# Altium schematic sheet TIDA-00643_C2000.SchDoc
size 431 x 279 mm; Date: Not shown in title block; ApprovedBy: Not shown in title block; CheckedBy: Not shown in title block; Author: Not shown in title block; CompanyName: Not shown in title block; Engineer: Not shown in title block; Organization: Not shown in title block; Address1: Not shown in title block; Address2: Not shown in title block; Address3: Not shown in title block; Address4: Not shown in title block; DocumentNumber: 5; Revision: Use project parameter SCH_Rev; SheetNumber: 5; SheetTotal: 5; PageSetup: Record=PageOptions|CenterHorizontal=True|CenterVertical=True|PrintScale=1.00|XCorrection=1.00|YCorrection=1.00|PrintKind=0|BorderSize=5000000|LeftOffset=0|BottomOffset=0|Orientation=2|PaperLength=1000|PaperWidth=1000|Scale=100|PaperSource=15|PrintQuality=600|MediaType=1|DitherType=10|PaperKind=Letter|PrintScaleMode=1; CurrentTime: Not shown in title block; CurrentDate: Not shown in title block; Time: Not shown in title block; DocumentFullPathAndName: Not shown in title block; DocumentName: Not shown in title block; ModifiedDate: Not shown in title block; ImagePath: Not shown in title block
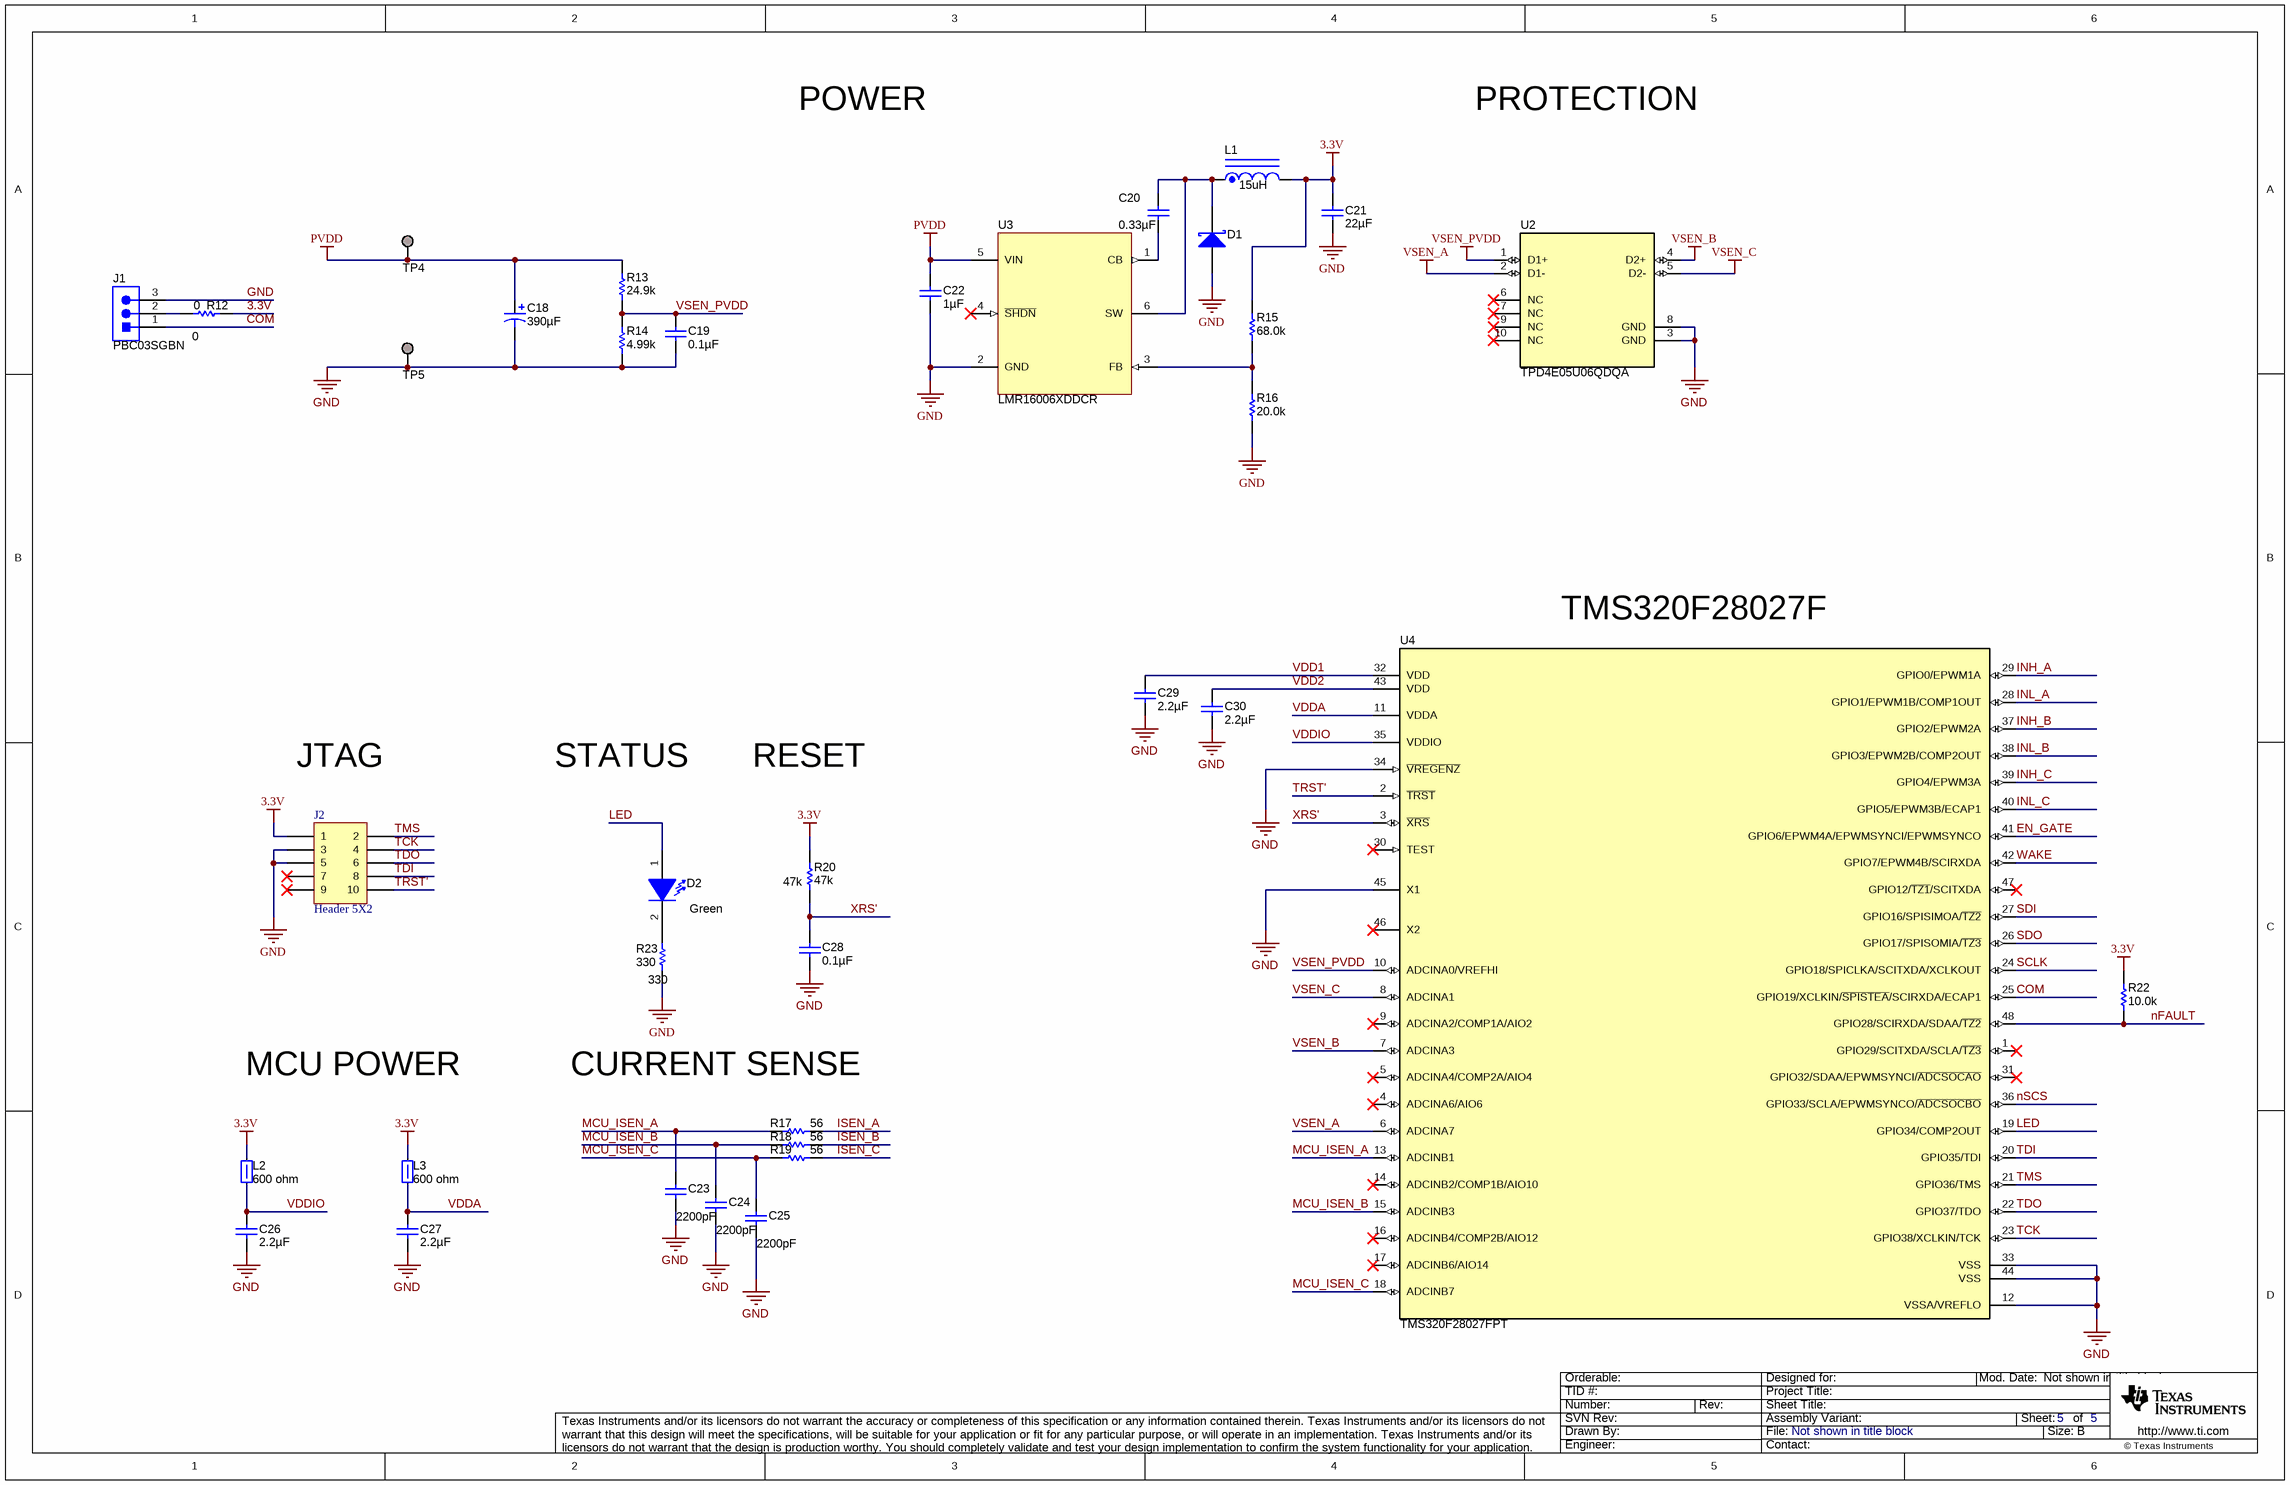
[diagram p0: TIDA-00643_C2000.SchDoc]

## Parts
C18  ValueDisplayed: 390µF  [CAPAE1030X1080]  (hidden comment: EEE-FPV391UAP)
C19  ValueDisplayed: 0.1µF  [0402L]  (hidden comment: 885012105016)
C20  ValueDisplayed: 0.33µF  [0603L]  (hidden comment: C0603C334Z3VACTU)
C21  ValueDisplayed: 22µF  [0805L]  (hidden comment: C2012X5R1C226K125AC)
C22  ValueDisplayed: 1µF  [0603L]  (hidden comment: GMK107BJ105KA-T)
C23  ValueDisplayed: 2200pF  [0402L]  (hidden comment: GRM155R71C222KA01D)
C24  ValueDisplayed: 2200pF  [0402L]  (hidden comment: GRM155R71C222KA01D)
C25  ValueDisplayed: 2200pF  [0402L]  (hidden comment: GRM155R71C222KA01D)
C26  ValueDisplayed: 2.2µF  [0603L]  (hidden comment: GRM188R61C225KE15D)
C27  ValueDisplayed: 2.2µF  [0603L]  (hidden comment: GRM188R61C225KE15D)
C28  ValueDisplayed: 0.1µF  [0402L]  (hidden comment: 885012105016)
C29  ValueDisplayed: 2.2µF  [0603L]  (hidden comment: GRM188R61C225KE15D)
C30  ValueDisplayed: 2.2µF  [0603L]  (hidden comment: GRM188R61C225KE15D)
D1  MBR1H100SFT3G  [SOD-123FL]  (value not drawn)
D2  value Green  [LED_LTST-C171]  (hidden comment: LTST-C171GKT)
J1  PBC03SGBN  [Sullins_xxC03SGBN]
J2  Header 5X2  [IDC DC3-10P 2X5P]
L1  value 15uH  [SD53]  (hidden comment: SD53-150-R)
L2  value 600 ohm  [0603L]  (hidden comment: BLM18KG601SN1D)
L3  value 600 ohm  [0603L]  (hidden comment: BLM18KG601SN1D)
R12  value 0  [0603L]  (hidden comment: CRCW06030000Z0EA)
R13  ValueDisplayed: 24.9k  [0603L]  (hidden comment: RC0603FR-0724K9L)
R14  ValueDisplayed: 4.99k  [0402L]  (hidden comment: CRCW04024K99FKED)
R15  ValueDisplayed: 68.0k  [0603L]  (hidden comment: RC0603FR-0768KL)
R16  ValueDisplayed: 20.0k  [0603L]  (hidden comment: CRCW060320K0FKEA)
R17  ValueDisplayed: 56  [0402L]  (hidden comment: CRCW040256R0JNED)
R18  ValueDisplayed: 56  [0402L]  (hidden comment: CRCW040256R0JNED)
R19  ValueDisplayed: 56  [0402L]  (hidden comment: CRCW040256R0JNED)
R20  value 47k  [0603L]  (hidden comment: CRCW060347K0JNEA)
R22  ValueDisplayed: 10.0k  [0603L]  (hidden comment: RC0603FR-0710KL)
R23  value 330  [0603L]  (hidden comment: CRCW0603330RJNEA)
TP4  TESTPOINT  [TESTPOINT]  (value not drawn)  (no BOM)
TP5  TESTPOINT  [TESTPOINT]  (value not drawn)  (no BOM)
U2  TPD4E05U06QDQA  [DQA0010A]
U3  LMR16006XDDCR  [DDC0006A_N]
U4  TMS320F28027FPT  [PT0048A_L]

## Nets
3.3V: C21.1 J2.1 L1.2 L2.2 L3.2 R12.2 R15.2 R20.2 R22.2
GND: C18.2(-) C19.2 C21.2 C22.2 C23.2 C24.2 C25.2 C26.2 C27.2 C28.2 C29.2 C30.2 D1.2(A) J1.3 J2.3 J2.5 R14.1 R16.1 R23.1 TP5.1 U2.3(GND) U2.8(GND) U3.2(GND) U4.12(VSSA/VREFLO) U4.33(VSS) U4.34(~{VREGENZ}) U4.44(VSS) U4.45(X1)
PVDD: C18.1(+) C22.1 R13.2 TP4.1 U3.5(VIN)
VSEN_A: U2.2(D1-) U4.6(ADCINA7)
VSEN_B: U2.4(D2+) U4.7(ADCINA3)
VSEN_C: U2.5(D2-) U4.8(ADCINA1)
VSEN_PVDD: C19.1 R13.1 R14.2 U2.1(D1+) U4.10(ADCINA0/VREFHI)
COM: J1.1 U4.25(GPIO19/XCLKIN/~{SPISTEA}/SCIRXDA/ECAP1)
EN_GATE: U4.41(GPIO6/EPWM4A/EPWMSYNCI/EPWMSYNCO)
INH_A: U4.29(GPIO0/EPWM1A)
INH_B: U4.37(GPIO2/EPWM2A)
INH_C: U4.39(GPIO4/EPWM3A)
INL_A: U4.28(GPIO1/EPWM1B/COMP1OUT)
INL_B: U4.38(GPIO3/EPWM2B/COMP2OUT)
INL_C: U4.40(GPIO5/EPWM3B/ECAP1)
ISEN_A: R17.2
ISEN_B: R18.2
ISEN_C: R19.2
LED: D2.1(A) U4.19(GPIO34/COMP2OUT)
MCU_ISEN_A: C23.1 R17.1 U4.13(ADCINB1)
MCU_ISEN_B: C24.1 R18.1 U4.15(ADCINB3)
MCU_ISEN_C: C25.1 R19.1 U4.18(ADCINB7)
nFAULT: R22.1 U4.48(GPIO28/SCIRXDA/SDAA/~{TZ2})
nSCS: U4.36(GPIO33/SCLA/EPWMSYNCO/~{ADCSOCBO})
SCLK: U4.24(GPIO18/SPICLKA/SCITXDA/XCLKOUT)
SDI: U4.27(GPIO16/SPISIMOA/~{TZ2})
SDO: U4.26(GPIO17/SPISOMIA/~{TZ3})
TCK: J2.4 U4.23(GPIO38/XCLKIN/TCK)
TDI: J2.8 U4.20(GPIO35/TDI)
TDO: J2.6 U4.22(GPIO37/TDO)
TMS: J2.2 U4.21(GPIO36/TMS)
TRST': J2.10 U4.2(~{TRST})
VDD1: C29.1 U4.32(VDD)
VDD2: C30.1 U4.43(VDD)
VDDA: C27.1 L3.1 U4.11(VDDA)
VDDIO: C26.1 L2.1 U4.35(VDDIO)
WAKE: U4.42(GPIO7/EPWM4B/SCIRXDA)
XRS': C28.1 R20.1 U4.3(~{XRS})
NetC20_1: C20.1 D1.1(K) L1.1 U3.6(SW)
NetC20_2: C20.2 U3.1(CB)
NetD2_2: D2.2(K) R23.2
NetJ1_2: J1.2 R12.1
NetR15_1: R15.1 R16.2 U3.3(FB)

Not connected (* = marked no-connect by the designer): J2 7* 9*; U2 6(NC)* 7(NC)* 9(NC)* 10(NC)*; U3 4(~{SHDN})*; U4 1(GPIO29/SCITXDA/SCLA/~{TZ3})* 4(ADCINA6/AIO6)* 5(ADCINA4/COMP2A/AIO4)* 9(ADCINA2/COMP1A/AIO2)* 14(ADCINB2/COMP1B/AIO10)* 16(ADCINB4/COMP2B/AIO12)* 17(ADCINB6/AIO14)* 30(TEST)* 31(GPIO32/SDAA/EPWMSYNCI/~{ADCSOCAO})* 46(X2)* 47(GPIO12/~{TZ1}/SCITXDA)*

## Notes on the sheet
- POWER
- PROTECTION
- (near U4) TMS320F28027F
- JTAG
- STATUS
- RESET
- MCU POWER
- CURRENT SENSE
- Drawn By:
- SVN Rev:
- Number:
- TID #:
- Orderable:
- Rev:
- Sheet Title:
- File:
- Project Title:
- Designed for:
- Assembly Variant:
- Mod. Date:
- Sheet:
- Size:
- of
- B
- http://www.ti.com
- Texas Instruments and/or its licensors do not warrant the accuracy or completeness of this specification or any information contained therein. Texas Instruments and/or its licensors do not warrant that this design will meet the specifications, will be suitable for your application or fit for any particular purpose, or will operate in an implementation. Texas Instruments and/or its licensors do not warrant that the design is production worthy. You should completely validate and test your design implementation to confirm the system functionality for your application.
- Engineer:
- Contact:
- © Texas Instruments

## Library data of the parts
C18 = EEE-FPV391UAP: CAP, AL, 390 µF, 35 V, +/- 20%, 0.08 ohm, SMD; Manufacturer: Panasonic; Polarized: Y; CompType: Capacitor; Value: 390uF; U/M: EA; Cap_F: 0.00039; Tolerance_%: 20; VDC_V: 35; Value2: 35V; ESR_ohm: 0.08; IRMS_A: 0.85; TaMin_C: -55; TaMax_C: 105; Cap_Case: 10x10.2mm; SymbolVersion: 2008-07-09; PartNumber: EEE-FPV391UAP; PackageReference: 10 x 10; RoHS: Y; Value1: 0.08 ohm; MountType: SMT; Technology: AL; Series: FP; Publisher: Texas Instruments; LatestRevisionDate: 2015-07-10; ComponentLink1Description: Datasheet link; ComponentLink1URL: http://industrial.panasonic.com/lecs/www-data/pdf/ABA0000/ABA0000CE114.pdf; Supplier 1: Digi-Key; Supplier Part Number 1: PCE4446CT-ND; Supplier 2: Mouser; Supplier Part Number 2: 667-EEE-FPV391UAP
C19 C28 = 885012105016: CAP, CERM, 0.1 µF, 16 V, +/- 20%, X5R, 0402; Manufacturer: Wurth Elektronik; Polarized: N; CompType: Capacitor; Value: 0.1uF; U/M: EA; Cap_F: 0.0000001; Tolerance_%: 20; Value1: Unknown; VDC_V: 16; Value2: 16V; TaMin_C: -55; TaMax_C: 85; Cap_Case: 0402; SymbolVersion: 2008-07-09; PartNumber: 885012105016; PackageReference: 0402; RoHS: Y; MountType: SMT; Technology: Ceramic; TempCo: X5R; Published: 2008-06-19; Publisher: Texas Instruments; LatestRevisionDate: 2015-07-15; ComponentLink1Description: Datasheet link; ComponentLink1URL: http://katalog.we-online.de/pbs/datasheet/885012105016.pdf; Supplier 1: Mouser; Supplier Part Number 1: 710-885012105016; Supplier 2: Newark; Supplier Part Number 2: 40Y4445
C20 = C0603C334Z3VACTU: CAP, CERM, 0.33 µF, 25 V, +80/-20%, Y5V, 0603; Manufacturer: Kemet; Polarized: N; CompType: Capacitor; Value: 0.33uF; U/M: EA; Cap_F: 0.00000033; Tolerance_%: 80; Value1: Unknown; VDC_V: 25; Value2: 25V; TaMin_C: -30; TaMax_C: 85; Cap_Case: 0603; SymbolVersion: 2008-07-09; PartNumber: C0603C334Z3VACTU; PackageReference: 0603; RoHS: Y; MountType: SMT; Technology: Ceramic; TempCo: Y5V; Published: 2008-06-19; Publisher: Texas Instruments; LatestRevisionDate: 2015-07-15; ComponentLink1Description: Datasheet link; ComponentLink1URL: http://www.kemet.com/kemet/web/homepage/kechome.nsf/vapubfiles/F3102_Y5V.pdf/$file/F3102_Y5V.pdf; Supplier 1: Digi-Key; Supplier Part Number 1: 399-1292-1-ND; Supplier 2: Mouser; Supplier Part Number 2: 80-C0603C334Z3V; Supplier 3: Farnell; Supplier Part Number 3: 1163537
C21 = C2012X5R1C226K125AC: CAP, CERM, 22 µF, 16 V, +/- 10%, X5R, 0805; Manufacturer: TDK; Polarized: N; CompType: Capacitor; Value: 22uF; U/M: EA; Cap_F: 0.000022; Tolerance_%: 10; Value1: Unknown; VDC_V: 16; Value2: 16V; TaMin_C: -55; TaMax_C: 85; Cap_Case: 0805; SymbolVersion: 2008-07-09; PartNumber: C2012X5R1C226K125AC; PackageReference: 0805; RoHS: Y; MountType: SMT; Technology: Ceramic; TempCo: X5R; Published: 2008-06-19; Publisher: Texas Instruments; LatestRevisionDate: 2015-07-15; ComponentLink1Description: Datasheet link; ComponentLink1URL: http://product.tdk.com/capacitor/mlcc/en/documents/C2012X5R1C226K125AC.pdf; Supplier 1: Digi-Key; Supplier Part Number 1: 445-6797-1-ND; Supplier 2: Mouser; Supplier Part Number 2: 810-C2012X5R1C226K; Supplier 3: Farnell; Supplier Part Number 3: 2346925
C22 = GMK107BJ105KA-T: CAP, CERM, 1 µF, 35 V, +/- 10%, X5R, 0603; Manufacturer: Taiyo Yuden; Polarized: N; CompType: Capacitor; Value: 1uF; U/M: EA; Cap_F: 0.000001; Tolerance_%: 10; Value1: Unknown; VDC_V: 35; Value2: 35V; TaMin_C: -55; TaMax_C: 85; Cap_Case: 0603; SymbolVersion: 2008-07-09; PartNumber: GMK107BJ105KA-T; PackageReference: 0603; RoHS: Y; MountType: SMT; Technology: Ceramic; TempCo: X5R; Published: 2008-06-19; Publisher: Texas Instruments; LatestRevisionDate: 2015-07-15; ComponentLink1Description: Datasheet link; ComponentLink1URL: http://www.yuden.co.jp/or/product/category/capacitor/GMK107BJ105KA-T.pdf; Supplier 1: Digi-Key; Supplier Part Number 1: 587-1437-1-ND; Supplier 2: Mouser; Supplier Part Number 2: 963-GMK107BJ105KA-T; Supplier 3: Newark; Supplier Part Number 3: 93K5526
C23-C25 = GRM155R71C222KA01D: CAP, CERM, 2200 pF, 16 V, +/- 10%, X7R, 0402; Manufacturer: MuRata; Polarized: N; CompType: Capacitor; Value: 2200pF; U/M: EA; Cap_F: 0.0000000022; Tolerance_%: 10; Value1: Unknown; VDC_V: 16; Value2: 16V; TaMin_C: -55; TaMax_C: 125; Cap_Case: 0402; SymbolVersion: 2008-07-09; PartNumber: GRM155R71C222KA01D; PackageReference: 0402; RoHS: Y; MountType: SMT; Technology: Ceramic; TempCo: X7R; Published: 2008-06-19; Publisher: Texas Instruments; LatestRevisionDate: 2015-07-15; ComponentLink1Description: Datasheet link; ComponentLink1URL: http://search.murata.co.jp/Ceramy/PnsearchViewAction.do?HnOFG=ON&HnNFG=ON&SEL_CNT=50&sLang=en&sKey=GRM155R71C222KA01D&x=9&y=9&search=startwith; Supplier 1: Digi-Key; Supplier Part Number 1: GRM155R71C222KA01D-ND; Supplier 2: Mouser; Supplier Part Number 2: 81-GRM155R71C222KA1D
C26 C27 C29 C30 = GRM188R61C225KE15D: CAP, CERM, 2.2 µF, 16 V, +/- 10%, X5R, 0603; Manufacturer: MuRata; Polarized: N; CompType: Capacitor; Value: 2.2uF; U/M: EA; Cap_F: 0.0000022; Tolerance_%: 10; Value1: Unknown; VDC_V: 16; Value2: 16V; TaMin_C: -55; TaMax_C: 85; Cap_Case: 0603; SymbolVersion: 2008-07-09; PartNumber: GRM188R61C225KE15D; PackageReference: 0603; RoHS: Y; MountType: SMT; Technology: Ceramic; TempCo: X5R; Published: 2008-06-19; Publisher: Texas Instruments; LatestRevisionDate: 2015-07-15; ComponentLink1Description: Datasheet link; ComponentLink1URL: http://psearch.murata.com/capacitor/product/GRM188R61C225KE15%23.pdf; Supplier 1: Digi-Key; Supplier Part Number 1: 490-3296-1-ND; Supplier 2: Mouser; Supplier Part Number 2: 81-GRM188R61C225KE15; Supplier 3: Farnell; Supplier Part Number 3: 1735526
D1 = MBR1H100SFT3G: Diode, Schottky, 100 V, 1 A, SOD-123FL; Manufacturer: ON Semiconductor; U/M: EA; Vf_V: 0.76; Value: 100V; Value1: 1A; Value2: 0.76V; Io_A: 1; Vr_V: 100; TJmax_C: 175; RJC_CperW: 85; CompType: Diode; SymbolVersion: 2008-12-08; PartNumber: MBR1H100SFT3G; PackageReference: SOD-123FL; MountType: SMT; Type: Schottky; RoHS: Y; Published: 2008-06-26; Publisher: Texas Instruments; LatestRevisionDate: 2015-07-16; ComponentLink1Description: Datasheet link; ComponentLink1URL: http://www.onsemi.com/pub_link/Collateral/MBR1H100SF-D.PDF; Supplier 1: Digi-Key; Supplier Part Number 1: MBR1H100SFT3GOSCT-ND; Supplier 2: Mouser; Supplier Part Number 2: 863-MBR1H100SFT3G
D2 = LTST-C171GKT: LED, Green, SMD; Manufacturer: Lite-On; Type: AlInGaP; Vf_V: 2.1; Value2: 2.1V; Io_A: 20; Value1: W; U/M: EA; CompType: LED; PartNumber: LTST-C171GKT; SymbolVersion: 2008-12-08; MountType: SMT; RoHS: Y; PackageReference: LED_0805; Color: green; Published: 2008-07-11; Publisher: Texas Instruments; ComponentLink1URL: https://sps06.itg.ti.com/sites/KMS/crossdivteams/altium/docs/ComponentDatasheets/LTST-C171GKT.pdf; ComponentLink1Description: Datasheet link; LatestRevisionDate: 2015-07-13; Supplier 1: Digi-Key; Supplier Part Number 1: 160-1423-1-ND; Supplier 2: Mouser; Supplier Part Number 2: 859-LTST-C171GKT
J1 = PBC03SGBN: Header, 2.54 mm, 3x1, Gold, R/A, TH; Manufacturer: Sullins Connector Solutions; SymbolCreator: a0799628; U/M: EA; SymbolVersion: 2013-03-28; PartNumber: PBC03SGBN; PackageReference: Header, 2.54 mm, 3x1, R/A, TH; ClassName: Header; CompType: Header; RoHS: Y; MountType: TH; ComponentLink1Description: Datasheet Link; ComponentLink1URL: http://www.sullinscorp.com/catalogs/77_PAGE108-109_.100_MALE_HDR.pdf; Publisher: Texas Instruments; LatestRevisionDate: 2015-07-16; Supplier 1: Digi-Key; Supplier Part Number 1: S1321E-03-ND
J2 = Header 5X2: Header, 5-Pin, Dual row; LatestRevisionDate: 17-Jul-2002; LatestRevisionNote: Re-released for DXP Platform.; Publisher: Altium Limited
L1 = SD53-150-R: Inductor, Shielded Drum Core, Ferrite, 15 µH, 1.1 A, 0.122 ohm, SMD; Manufacturer: Cooper Bussman; SymbolCreator: a0412235; Ind_H: 15.0E-6; ValueDisplayed: 15µH; Imax_A: 1.1; Irms: 1.1A @ 40C rise; Isat: 1.1A @ 30% inductance drop; DCR_ohm: 0.122; Value2: 1.1A; SymbolVersion: 2013-02-25; PartNumber: SD53-150-R; CompType: Inductor; Value1: 0.122 ohm; Technology: Shielded Drum Core; MountType: SMT; Material: Ferrite; PackageReference: 5.72x3x5.2mm; Published: 2008-06-26; Publisher: Texas Instruments; LatestRevisionDate: 2015-06-30; ComponentLink1Description: Datasheet link; ComponentLink1URL: http://www.cooperindustries.com/content/dam/public/bussmann/Electronics/Resources/Data%20Sheets/Bus_Elx_DS_PM%204149_SD53_Series.pdf; RoHS: Y; Supplier 1: Digi-Key; Supplier Part Number 1: 513-1458-1-ND; Supplier 2: Mouser; Supplier Part Number 2: 704-SD53-150-R; Supplier 3: Newark; Supplier Part Number 3: 99M5528
L2 L3 = BLM18KG601SN1D: Ferrite Bead, 600 ohm @ 100 MHz, 1.3 A, 0603; Manufacturer: MuRata; Imax_A: 1.3; DCR_ohm: 0.15; Value1: 0.15 ohm; Value2: 1.3A; ZTyp@100MHz_Ohm: 600; CompType: Ferrite Bead; SymbolVersion: 2009-06-02; PartNumber: BLM18KG601SN1D; MountType: SMT; PackageReference: 0603; Published: 2014-04-30; Publisher: Texas Instruments; LatestRevisionDate: 2015-06-30; ComponentLink1Description: Datasheet link; ComponentLink1URL: http://search.murata.co.jp/Ceramy/image/img/PDF/ENG/L0110S0100BLM18K.pdf; RoHS: Y; Supplier 1: Digi-Key; Supplier Part Number 1: 490-5258-1-ND; Supplier 2: Mouser; Supplier Part Number 2: 81-BLM18KG601SN1D; Supplier 3: Farnell; Supplier Part Number 3: 1781094
R12 = CRCW06030000Z0EA: RES, 0, 5%, 0.1 W, 0603; Manufacturer: Vishay-Dale; CompType: Resistor; Value_Code: 0000; Tolerance_%: 5; Power_W: 0.1; Value2: 0.1W; VDC_V: 75; TempCo: 200 ppm/C; EIA_Code: E24; U/M: EA; SymbolVersion: 2009-05-29; PartNumber: CRCW06030000Z0EA; PackageReference: 0603; RoHS: Y; Res_ohm: 0; Value1: 5%; MountType: SMT; Technology: Thick Film; Published: 2008-06-26; Publisher: Texas Instruments; LatestRevisionDate: 2015-06-13; ComponentLink1Description: Datasheet link; ComponentLink1URL: http://www.vishay.com/docs/20035/dcrcwe3.pdf; Supplier 1: Digi-Key; Supplier Part Number 1: 541-0.0GCT-ND; Supplier 2: Mouser; Supplier Part Number 2: 71-CRCW0603-0-E3; Supplier 3: Farnell; Supplier Part Number 3: 1469739; ValueDisplayed: 0
R13 = RC0603FR-0724K9L: RES, 24.9 k, 1%, 0.1 W, 0603; Manufacturer: Yageo America; CompType: Resistor; Value: 24.9k; Res_ohm: 24900; Value_Code: 24k9; Tolerance_%: 1; Power_W: 0.1; Value2: 0.1W; VDC_V: 150; TempCo: 200 ppm/C; EIA_Code: E96; U/M: EA; SymbolVersion: 2009-05-29; PartNumber: RC0603FR-0724K9L; PackageReference: 0603; RoHS: Y; Value1: 1%; MountType: SMT; Technology: Thick Film; Published: 2008-06-26; Publisher: Texas Instruments; LatestRevisionDate: 2015-06-13; ComponentLink1Description: Datasheet link; ComponentLink1URL: http://www.yageo.com/pdf/Pu-RC0603_51_PbFree_L_2.pdf; Supplier 1: Digi-Key; Supplier Part Number 1: 311-24.9KHRCT-ND; Supplier 2: Mouser; Supplier Part Number 2: 603-RC0603FR-0724K9L; Supplier 3: Farnell; Supplier Part Number 3: 1799336
R14 = CRCW04024K99FKED: RES, 4.99 k, 1%, 0.063 W, 0402; Manufacturer: Vishay-Dale; CompType: Resistor; Value: 4.99k; Res_ohm: 4990; Value_Code: 4k99; Tolerance_%: 1; Power_W: 0.063; Value2: 0.063W; VDC_V: 50; TempCo: 100 ppm/C; EIA_Code: E96; U/M: EA; SymbolVersion: 2009-05-29; PartNumber: CRCW04024K99FKED; PackageReference: 0402; RoHS: Y; Value1: 1%; MountType: SMT; Technology: Thick Film; Published: 2008-06-26; Publisher: Texas Instruments; LatestRevisionDate: 2015-07-01; ComponentLink1Description: Datasheet link; ComponentLink1URL: http://www.vishay.com/docs/20035/dcrcwe3.pdf; Supplier 1: Digi-Key; Supplier Part Number 1: 541-4.99KLCT-ND; Supplier 2: Mouser; Supplier Part Number 2: 71-CRCW0402-4.99K-E3; Supplier 3: Farnell; Supplier Part Number 3: 1469715
R15 = RC0603FR-0768KL: RES, 68.0 k, 1%, 0.1 W, 0603; Manufacturer: Yageo America; CompType: Resistor; Value: 68.0k; Res_ohm: 68000; Value_Code: 68k0; Tolerance_%: 1; Power_W: 0.1; Value2: 0.1W; VDC_V: 150; TempCo: 200 ppm/C; U/M: EA; SymbolVersion: 2009-05-29; PartNumber: RC0603FR-0768KL; PackageReference: 0603; RoHS: Y; Value1: 1%; MountType: SMT; Technology: Thick Film; Published: 2008-06-26; Publisher: Texas Instruments; LatestRevisionDate: 2015-06-13; ComponentLink1Description: Datasheet link; ComponentLink1URL: http://www.yageo.com/pdf/Pu-RC0603_51_PbFree_L_2.pdf; Supplier 1: Digi-Key; Supplier Part Number 1: 311-68.0KHRCT-ND; Supplier 2: Mouser; Supplier Part Number 2: 603-RC0603FR-0768KL; Supplier 3: Farnell; Supplier Part Number 3: 9238700
R16 = CRCW060320K0FKEA: RES, 20.0 k, 1%, 0.1 W, 0603; Manufacturer: Vishay-Dale; CompType: Resistor; Value: 20.0k; Res_ohm: 20000; Value_Code: 20k0; Tolerance_%: 1; Power_W: 0.1; Value2: 0.1W; VDC_V: 75; TempCo: 100 ppm/C; EIA_Code: E96; U/M: EA; SymbolVersion: 2009-05-29; PartNumber: CRCW060320K0FKEA; PackageReference: 0603; RoHS: Y; Value1: 1%; MountType: SMT; Technology: Thick Film; Published: 2008-06-26; Publisher: Texas Instruments; LatestRevisionDate: 2015-06-13; ComponentLink1Description: Datasheet link; ComponentLink1URL: http://www.vishay.com/docs/20035/dcrcwe3.pdf; Supplier 1: Digi-Key; Supplier Part Number 1: 541-20.0KHCT-ND; Supplier 2: Mouser; Supplier Part Number 2: 71-CRCW0603-20K-E3; Supplier 3: Farnell; Supplier Part Number 3: 1469774
R17-R19 = CRCW040256R0JNED: RES, 56, 5%, 0.063 W, 0402; Manufacturer: Vishay-Dale; CompType: Resistor; Value: 56; Value_Code: 56R0; Tolerance_%: 5; Power_W: 0.063; Value2: 0.063W; VDC_V: 50; TempCo: 200 ppm/C; EIA_Code: E24; U/M: EA; SymbolVersion: 2009-05-29; PartNumber: CRCW040256R0JNED; PackageReference: 0402; RoHS: Y; Res_ohm: 56; Value1: 5%; MountType: SMT; Technology: Thick Film; Published: 2008-06-26; Publisher: Texas Instruments; LatestRevisionDate: 2015-07-01; ComponentLink1Description: Datasheet link; ComponentLink1URL: http://www.vishay.com/docs/20035/dcrcwe3.pdf; Supplier 1: Digi-Key; Supplier Part Number 1: 541-56JCT-ND; Supplier 2: Mouser; Supplier Part Number 2: 71-CRCW0402J-56-E3; Supplier 3: Farnell; Supplier Part Number 3: 1570684
R20 = CRCW060347K0JNEA: RES, 47 k, 5%, 0.1 W, 0603; Manufacturer: Vishay-Dale; CompType: Resistor; Res_ohm: 47000; Value_Code: 47k0; Tolerance_%: 5; Power_W: 0.1; Value2: 0.1W; VDC_V: 75; TempCo: 200 ppm/C; EIA_Code: E24; U/M: EA; SymbolVersion: 2009-05-29; PartNumber: CRCW060347K0JNEA; PackageReference: 0603; RoHS: Y; Value1: 5%; MountType: SMT; Technology: Thick Film; Published: 2008-06-26; Publisher: Texas Instruments; LatestRevisionDate: 2015-06-13; ComponentLink1Description: Datasheet link; ComponentLink1URL: http://www.vishay.com/docs/20035/dcrcwe3.pdf; Supplier 1: Digi-Key; Supplier Part Number 1: 541-47KGCT-ND; Supplier 2: Mouser; Supplier Part Number 2: 71-CRCW060347K0JNEA; Supplier 3: Farnell; Supplier Part Number 3: 1652881; ValueDisplayed: 47k
R22 = RC0603FR-0710KL: RES, 10.0 k, 1%, 0.1 W, 0603; Manufacturer: Yageo America; CompType: Resistor; Value: 10.0k; Res_ohm: 10000; Value_Code: 10k0; Tolerance_%: 1; Power_W: 0.1; Value2: 0.1W; VDC_V: 150; TempCo: 200 ppm/C; EIA_Code: E96; U/M: EA; SymbolVersion: 2009-05-29; PartNumber: RC0603FR-0710KL; PackageReference: 0603; RoHS: Y; Value1: 1%; MountType: SMT; Technology: Thick Film; Published: 2008-06-26; Publisher: Texas Instruments; LatestRevisionDate: 2015-06-13; ComponentLink1Description: Datasheet link; ComponentLink1URL: http://www.yageo.com/pdf/Pu-RC0603_51_PbFree_L_2.pdf; Supplier 1: Digi-Key; Supplier Part Number 1: 311-10.0KHRCT-ND; Supplier 2: Mouser; Supplier Part Number 2: 603-RC0603FR-0710KL; Supplier 3: Farnell; Supplier Part Number 3: 9238603
R23 = CRCW0603330RJNEA: RES, 330, 5%, 0.1 W, 0603; Manufacturer: Vishay-Dale; CompType: Resistor; Value_Code: 330R; Tolerance_%: 5; Power_W: 0.1; Value2: 0.1W; VDC_V: 75; TempCo: 200 ppm/C; EIA_Code: E24; U/M: EA; SymbolVersion: 2009-05-29; PartNumber: CRCW0603330RJNEA; PackageReference: 0603; RoHS: Y; Res_ohm: 330; Value1: 5%; MountType: SMT; Technology: Thick Film; Published: 2008-06-26; Publisher: Texas Instruments; LatestRevisionDate: 2015-06-13; ComponentLink1Description: Datasheet link; ComponentLink1URL: http://www.vishay.com/docs/20035/dcrcwe3.pdf; Supplier 1: Digi-Key; Supplier Part Number 1: 541-330GCT-ND; Supplier 2: Mouser; Supplier Part Number 2: 71-CRCW0603J-330-E3; Supplier 3: Farnell; Supplier Part Number 3: 1692522; ValueDisplayed: 330
TP4 TP5 = TESTPOINT: TEST POINT.  No entry in BOM.; SymbolVersion: 2010-10-20; CompType: Testpoint; PackageReference: N/A; Publisher: Texas Instruments; LatestRevisionDate: 2015-06-01; LatestRevisionNote: Added Alternate PartNumber and Alternate Manufacturer parameters to appropriate components.
U2 = TPD4E05U06QDQA: 4 Channel Protection Solution for Super-Speed (up to 6 GBPS) Interface, DQA0010A; Manufacturer: Texas Instruments; SymbolCreator: a0411947; CompType: IC; U/M: EA; SymbolVersion: 2013-08-01; PartNumber: TPD4E05U06QDQA; PackageReference: DQA0010A; MountType: SMT; ComponentLink1Description: Datasheet Link; ComponentLink1URL: https://sps06.itg.ti.com/sites/KMS/crossdivteams/altium/docs/ComponentDatasheets/tpd4e05u06.pdf; RoHS: Y; Publisher: Texas Instruments; LatestRevisionDate: 2015-07-06; Alternate Manufacturer: Texas Instruments
U3 = LMR16006XDDCR: Wide Input Voltage Range Buck Regulator with High Efficiency Sleep Mode, DDC0006A; Alternate PartNumber: LMR16006XDDCT; Manufacturer: Texas Instruments; SymbolCreator: x0208326; CompType: IC; U/M: EA; SymbolVersion: 2013-12-17; PartNumber: LMR16006XDDCR; PackageReference: DDC0006A; MountType: SMT; ComponentLink1Description: Datasheet Link; ComponentLink1URL: http://www.ti.com/lit/ds/symlink/lmr16006.pdf; RoHS: Y; Publisher: Texas Instruments; LatestRevisionDate: 2015-07-09; Alternate Manufacturer: Texas Instruments
U4 = TMS320F28027FPTQ: Piccolo Microcontroller, PT0048A; Alternate PartNumber: TMS320F28027FPTT; Manufacturer: Texas Instruments; SymbolCreator: Altium; CompType: IC; U/M: EA; SymbolVersion: 2015-06-16; PartNumber: TMS320F28027FPT; PackageReference: PT0048A; MountType: SMT; ComponentLink1Description: Datasheet Link; ComponentLink1URL: http://www.ti.com/lit/ds/symlink/tms320f28027f.pdf; RoHS: Y; Publisher: Texas Instruments; LatestRevisionDate: 2015-06-29; Alternate Manufacturer: Texas Instruments